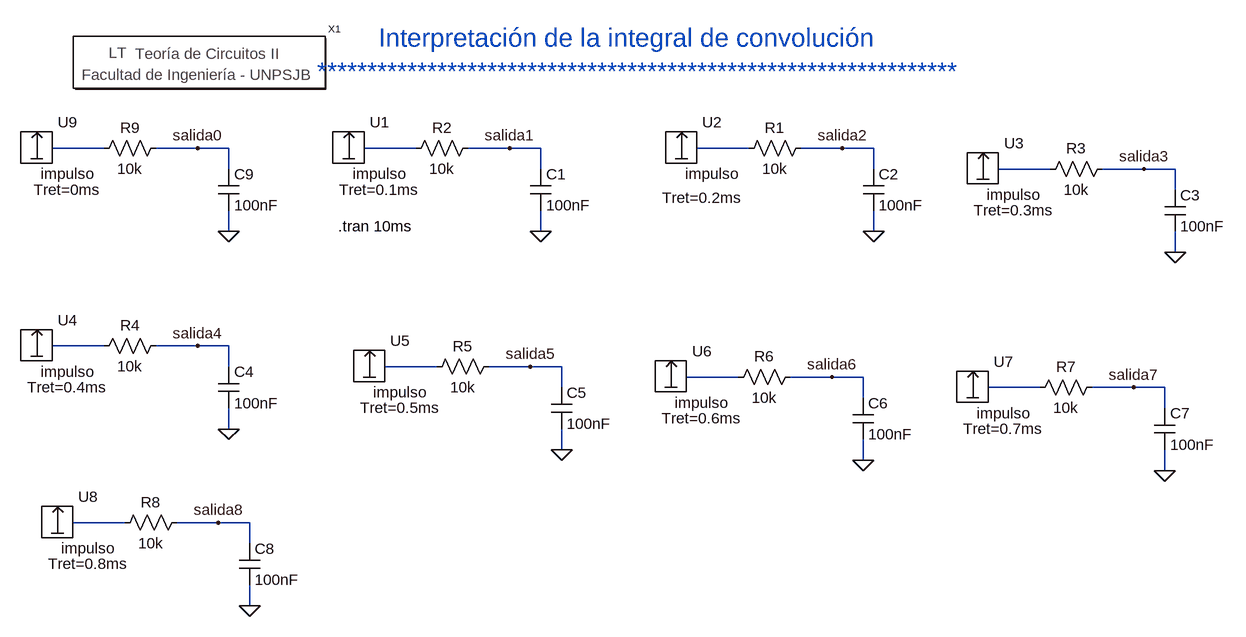
[diagram p0: schematic Interpretación de la integral de convolución.asc]
Interpretación de la integral de convolución.asc, the LTspice schematic file:
Version 4
SHEET 1 912 2164
WIRE -1424 -192 -1504 -192
WIRE -1280 -192 -1344 -192
WIRE -1232 -192 -1280 -192
WIRE -944 -192 -1024 -192
WIRE -800 -192 -864 -192
WIRE -752 -192 -800 -192
WIRE -432 -192 -512 -192
WIRE -288 -192 -352 -192
WIRE -240 -192 -288 -192
WIRE -1232 -160 -1232 -192
WIRE -752 -160 -752 -192
WIRE -240 -160 -240 -192
WIRE 32 -160 -48 -160
WIRE 176 -160 112 -160
WIRE 224 -160 176 -160
WIRE 224 -128 224 -160
WIRE -1232 -64 -1232 -96
WIRE -752 -64 -752 -96
WIRE -240 -64 -240 -96
WIRE 224 -32 224 -64
WIRE -1424 112 -1504 112
WIRE -1280 112 -1344 112
WIRE -1232 112 -1280 112
WIRE -1232 144 -1232 112
WIRE -912 144 -992 144
WIRE -768 144 -832 144
WIRE -720 144 -768 144
WIRE -448 160 -528 160
WIRE -304 160 -368 160
WIRE -256 160 -304 160
WIRE -720 176 -720 144
WIRE 16 176 -64 176
WIRE 160 176 96 176
WIRE 208 176 160 176
WIRE -256 192 -256 160
WIRE 208 208 208 176
WIRE -1232 240 -1232 208
WIRE -720 272 -720 240
WIRE -256 288 -256 256
WIRE 208 304 208 272
WIRE -1392 384 -1472 384
WIRE -1248 384 -1312 384
WIRE -1200 384 -1248 384
WIRE -1200 416 -1200 384
WIRE -1200 512 -1200 480
FLAG -752 -64 0
FLAG -800 -192 salida1
FLAG -240 -64 0
FLAG -288 -192 salida2
FLAG 224 -32 0
FLAG 176 -160 salida3
FLAG -1232 240 0
FLAG -1280 112 salida4
FLAG -720 272 0
FLAG -768 144 salida5
FLAG -256 288 0
FLAG -304 160 salida6
FLAG 208 304 0
FLAG 160 176 salida7
FLAG -1200 512 0
FLAG -1248 384 salida8
FLAG -1232 -64 0
FLAG -1280 -192 salida0
SYMBOL impulso -1008 -192 R0
SYMATTR InstName U1
SYMBOL cap -768 -160 R0
SYMATTR InstName C1
SYMATTR Value 100nF
SYMBOL res -848 -208 R90
WINDOW 0 0 56 VBottom 2
WINDOW 3 32 56 VTop 2
SYMATTR InstName R2
SYMATTR Value 10k
SYMBOL impulso -496 -192 R0
WINDOW 39 -7 61 Top 2
SYMATTR SpiceLine Tret=0.2ms
SYMATTR InstName U2
SYMBOL cap -256 -160 R0
SYMATTR InstName C2
SYMATTR Value 100nF
SYMBOL res -336 -208 R90
WINDOW 0 0 56 VBottom 2
WINDOW 3 32 56 VTop 2
SYMATTR InstName R1
SYMATTR Value 10k
SYMBOL impulso -32 -160 R0
SYMATTR InstName U3
SYMATTR SpiceLine Tret=0.3ms
SYMBOL cap 208 -128 R0
SYMATTR InstName C3
SYMATTR Value 100nF
SYMBOL res 128 -176 R90
WINDOW 0 0 56 VBottom 2
WINDOW 3 32 56 VTop 2
SYMATTR InstName R3
SYMATTR Value 10k
SYMBOL impulso -1488 112 R0
SYMATTR InstName U4
SYMATTR SpiceLine Tret=0.4ms
SYMBOL cap -1248 144 R0
SYMATTR InstName C4
SYMATTR Value 100nF
SYMBOL res -1328 96 R90
WINDOW 0 0 56 VBottom 2
WINDOW 3 32 56 VTop 2
SYMATTR InstName R4
SYMATTR Value 10k
SYMBOL impulso -976 144 R0
SYMATTR InstName U5
SYMATTR SpiceLine Tret=0.5ms
SYMBOL cap -736 176 R0
SYMATTR InstName C5
SYMATTR Value 100nF
SYMBOL res -816 128 R90
WINDOW 0 0 56 VBottom 2
WINDOW 3 32 56 VTop 2
SYMATTR InstName R5
SYMATTR Value 10k
SYMBOL impulso -512 160 R0
SYMATTR InstName U6
SYMATTR SpiceLine Tret=0.6ms
SYMBOL cap -272 192 R0
SYMATTR InstName C6
SYMATTR Value 100nF
SYMBOL res -352 144 R90
WINDOW 0 0 56 VBottom 2
WINDOW 3 32 56 VTop 2
SYMATTR InstName R6
SYMATTR Value 10k
SYMBOL impulso -48 176 R0
SYMATTR InstName U7
SYMATTR SpiceLine Tret=0.7ms
SYMBOL cap 192 208 R0
SYMATTR InstName C7
SYMATTR Value 100nF
SYMBOL res 112 160 R90
WINDOW 0 0 56 VBottom 2
WINDOW 3 32 56 VTop 2
SYMATTR InstName R7
SYMATTR Value 10k
SYMBOL impulso -1456 384 R0
SYMATTR InstName U8
SYMATTR SpiceLine Tret=0.8ms
SYMBOL cap -1216 416 R0
SYMATTR InstName C8
SYMATTR Value 100nF
SYMBOL res -1296 368 R90
WINDOW 0 0 56 VBottom 2
WINDOW 3 32 56 VTop 2
SYMATTR InstName R8
SYMATTR Value 10k
SYMBOL impulso -1488 -192 R0
SYMATTR InstName U9
SYMATTR SpiceLine Tret=0ms
SYMBOL cap -1248 -160 R0
SYMATTR InstName C9
SYMATTR Value 100nF
SYMBOL res -1328 -208 R90
WINDOW 0 0 56 VBottom 2
WINDOW 3 32 56 VTop 2
SYMATTR InstName R9
SYMATTR Value 10k
SYMBOL Circuitos2\\Letreros\\Teoría\ de\ Circuitos\ II -1280 -320 R0
SYMATTR InstName X1
TEXT -1064 -72 Left 2 !.tran 10ms
TEXT -616 -336 Center 4 ;Interpretación de la integral de convolución\n****************************************************************

The netlist it stands for:
* Interpretación de la integral de convolución.asc
XU1 N002 impulso Tret=0.1ms  ; pins 1
C1 salida1 0 100nF
R2 salida1 N002 10k
XU2 N003 impulso Tret=0.2ms  ; pins 1
C2 salida2 0 100nF
R1 salida2 N003 10k
XU3 N004 impulso Tret=0.3ms  ; pins 1
C3 salida3 0 100nF
R3 salida3 N004 10k
XU4 N005 impulso Tret=0.4ms  ; pins 1
C4 salida4 0 100nF
R4 salida4 N005 10k
XU5 N006 impulso Tret=0.5ms  ; pins 1
C5 salida5 0 100nF
R5 salida5 N006 10k
XU6 N007 impulso Tret=0.6ms  ; pins 1
C6 salida6 0 100nF
R6 salida6 N007 10k
XU7 N008 impulso Tret=0.7ms  ; pins 1
C7 salida7 0 100nF
R7 salida7 N008 10k
XU8 N009 impulso Tret=0.8ms  ; pins 1
C8 salida8 0 100nF
R8 salida8 N009 10k
XU9 N001 impulso Tret=0ms  ; pins 1
C9 salida0 0 100nF
R9 salida0 N001 10k
XX1 Teoría de Circuitos II
.tran 10ms
* Interpretación de la integral de convolución
* ****************************************************************
.lib ..\sym\Circuitos2\Bloques\Bloques.lib
.backanno
.end